# Altium schematic sheet TX_RasPi_Ext_Sheet1.SchDoc
size A2
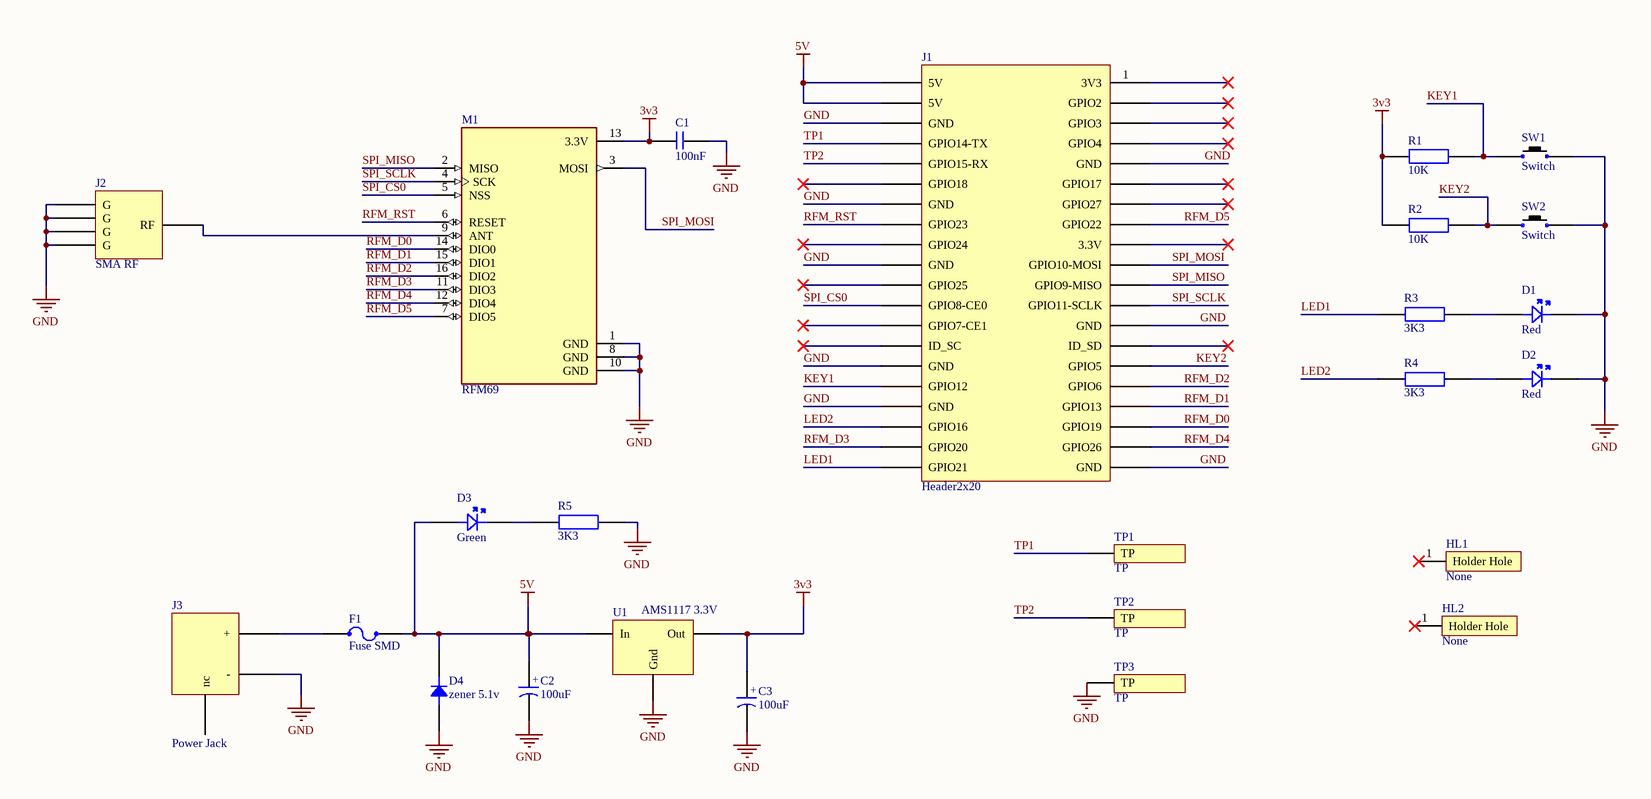
[diagram p0: TX_RasPi_Ext_Sheet1.SchDoc]

## Parts
C1  100nF  [CAP_0805]
C2  100uF  [Cap_Tan_Size_B]
C3  100uF  [Cap_Tan_Size_B]
D1  Red  [LED_0805_Red]
D2  Red  [LED_0805_Red]
D3  Green  [LED_0805_Green]
D4  zener 5.1v  [LL4148]
F1  Fuse SMD  [fuse_1206]
HL1  None  [Holder_hole]  (no BOM)
HL2  None  [Holder_hole]  (no BOM)
J1  Header2x20  [Header_2x20_female]
J2  SMA RF  [SMA_RF_RIGHT]
J3  Power Jack  [power_jack_5mm]
M1  RFM69  [RFM95W]
R1  10K  [RES_0805]
R2  10K  [RES_0805]
R3  3K3  [RES_0805]
R4  3K3  [RES_0805]
R5  3K3  [RES_0805]
SW1  Switch  [Tact_SW_SMD]
SW2  Switch  [Tact_SW_SMD]
TP1  TP  [TP]  (no BOM)
TP2  TP  [TP]  (no BOM)
TP3  TP  [TP]  (no BOM)
U1  AMS1117 3.3V  [AMS1117-SOT223]

## Nets
3v3: C1.2 C3.+ M1.13(3.3V) R1.1 R2.1 U1.3(Out)
5V: C2.+ D3.1 D4.K F1.1 J1.2(5V) J1.4(5V) U1.1(In)
GND: C1.1 C2.- C3.- D1.2 D2.2 D4.A J1.6(GND) J1.9(GND) J1.14(GND) J1.20(GND) J1.25(GND) J1.30(GND) J1.34(GND) J1.39(GND) J2.2(G) J2.3(G) J2.4(G) J2.5(G) J3.1(-) M1.1(GND) M1.8(GND) M1.10(GND) R5.2 SW1.1 SW2.1 TP3.1(TP) U1.2(Gnd)
KEY1: J1.32(GPIO12) R1.2 SW1.2
KEY2: J1.29(GPIO5) R2.2 SW2.2
LED1: J1.40(GPIO21) R3.1
LED2: J1.36(GPIO16) R4.1
RFM_D0: J1.35(GPIO19) M1.14(DIO0)
RFM_D1: J1.33(GPIO13) M1.15(DIO1)
RFM_D2: J1.31(GPIO6) M1.16(DIO2)
RFM_D3: J1.38(GPIO20) M1.11(DIO3)
RFM_D4: J1.37(GPIO26) M1.12(DIO4)
RFM_D5: J1.15(GPIO22) M1.7(DIO5)
RFM_RST: J1.16(GPIO23) M1.6(RESET)
SPI_CS0: J1.24(GPIO8-CE0) M1.5(NSS)
SPI_MISO: J1.21(GPIO9-MISO) M1.2(MISO)
SPI_MOSI: J1.19(GPIO10-MOSI) M1.3(MOSI)
SPI_SCLK: J1.23(GPIO11-SCLK) M1.4(SCK)
TP1: J1.8(GPIO14-TX) TP1.1(TP)
TP2: J1.10(GPIO15-RX) TP2.1(TP)
NetD1_1: D1.1 R3.2
NetD2_1: D2.1 R4.2
NetD3_2: D3.2 R5.1
NetF1_2: F1.2 J3.2(+)
NetJ2_1: J2.1(RF) M1.9(ANT)

Not connected (* = marked no-connect by the designer): HL1 1(Holder_Hole)*; HL2 1(Holder_Hole)*; J1 1(3V3)* 3(GPIO2)* 5(GPIO3)* 7(GPIO4)* 11(GPIO17)* 12(GPIO18)* 13(GPIO27)* 17(3.3V)* 18(GPIO24)* 22(GPIO25)* 26(GPIO7-CE1)* 27(ID_SD)* 28(ID_SC)*; J3 3(nc)

## Library data of the parts
C1 = Cap0805: Capacitor SMD 0805
C2 C3 = Cap_Tant_B: Capacitor SMD Tantalium Size B
D1 D2 = LED_0805_Red: LED SMD 0805 Red
D3 = LED_0805_Green: LED SMD 0805 Green
D4 = Diode_LL4148: Diode SMD LL4148 1206
F1 = Fuse1206: Fuse SMD 1206
HL1 HL2 = Holder_Hole: PCB Holder Hole
J1 = Header2x20: Pin Header 2x20 pitch=2.54mm
J2 = SMA_RF
J3 = power_jack_5mm
M1 = RFM95W-915S2: General ISM < 1GHz LoRaâ„¢ Transceiver Module 915MHz Surface Mount; pin to pad: 1>GND 2>MISO 3>MOSI 4>SCK 5>NSS 6>RESET 7>DIO5 8>GND 9>ANT 10>GND 11>DIO3 12>DIO4 13>3V3 14>DIO0 15>DIO1 16>DIO2; MF: RF Solutions; Availability: Unavailable; SnapEDA_Link: https://www.snapeda.com/parts/RFM95W-915S2/RF%20Solutions/view-part/585488/?ref=snap; MP: RFM95W-915S2; Price: None; Value: *; Package: SMD-16 RF Solutions
R1-R5 = Res0805: Resistor SMD 0805
SW1 SW2 = Tact_sw: Tact switch SMD 2pin
TP1-TP3 = TP: Test point
U1 = AMS1117-SOT223: AMS1117 Regulator 3.3V SMD SOT223; pin to pad: 1>In 2>Gnd_Adj 3>Out